# EAGLE schematic base (EAGLE 5.10)
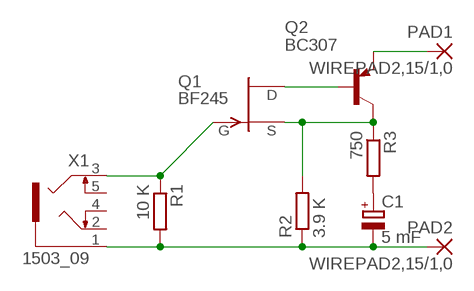
[diagram p0: schematic, sheet 1]

## Parts
C1  5 mF  CPOL-EUE2.5-6  [E2,5-6]
PAD1  WIREPAD2,15/1,0  [2,15/1,0]
PAD2  WIREPAD2,15/1,0  [2,15/1,0]
Q1  BF245  [TO92]
Q2  BC307  [TO92]
R1  10 K  R-EU_0207/12  [0207/12]
R2  3.9 K  R-EU_0207/12  [0207/12]
R3  750  R-EU_0207/12  [0207/12]
X1  1503_09  [1503_09]

## Nets
N$1: C1.- PAD2.1(P) R1.2 R2.1 X1.1
N$2: Q1.3(G) R1.1 X1.3
N$3: Q1.2(S) Q2.3(C) R2.2 R3.1
N$4: Q1.1(D) Q2.2(B)
N$5: C1.+ R3.2
N$6: PAD1.1(P) Q2.1(E)
Unconnected: X1.2 X1.4 X1.5

## Library data of the parts
C1 = rcl:CPOL-EU: POLARIZED CAPACITOR, European symbol
PAD1 PAD2 = wirepad:WIREPAD: Wire PAD connect wire on PCB
Q1 = transistor-fet:BF245: N-Channel Junction FET http://www.onsemi.com/pub/Collateral/BF245A-D.PDF
Q2 = transistor-pnp:BC307: PNP Transistor
R1-R3 = resistor:R-EU_: RESISTOR, European symbol
X1 = con-lumberg:1503_09: Jack connectors according to JISC 6560, 3.5 mm Klinkeneinbaukupplung nach JISC 6560, 3,5 mm, 3-polig/ stereo, abgewinkelte Ausführung, mit 2 Öffnern und Lötaugen, für Leiterplatten Rückseitenmontage Source: http://www.lumberg.com/Produkte/PDFs/1503_09.pdf